# Altium schematic sheet USB U-Turn.SchDoc
size B
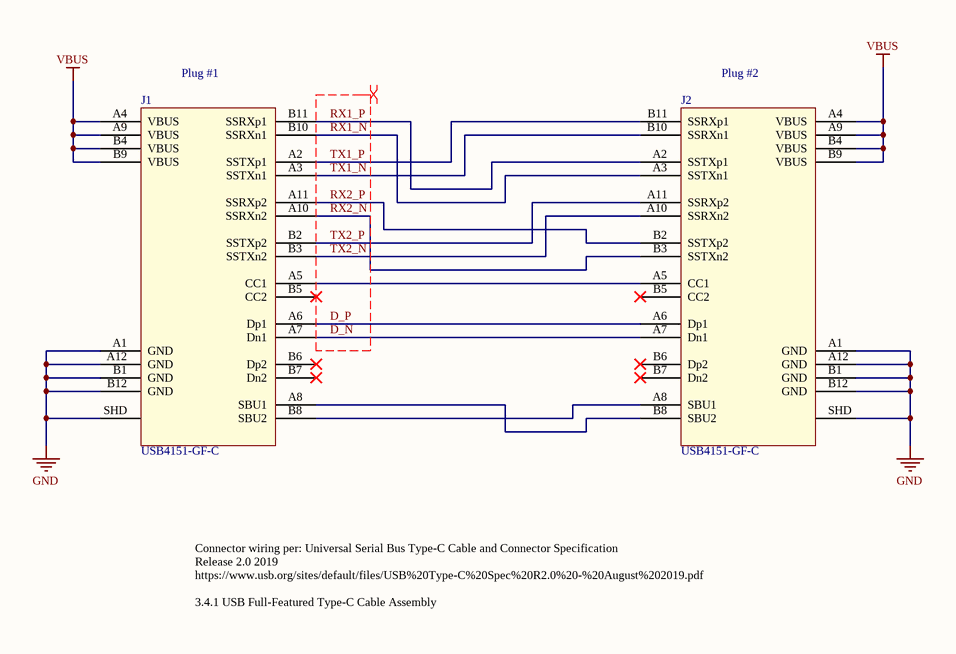
[diagram p0: USB U-Turn.SchDoc]

## Parts
J1  USB4151-GF-C  [USB4151-GF-C]
J2  USB4151-GF-C  [USB4151-GF-C]

## Nets
GND: J1.A1(GND) J1.A12(GND) J1.B1(GND) J1.B12(GND) J1.SHD(B13) J2.A1(GND) J2.A12(GND) J2.B1(GND) J2.B12(GND) J2.SHD(B13)
VBUS: J1.A4(VBUS) J1.A9(VBUS) J1.B4(VBUS) J1.B9(VBUS) J2.A4(VBUS) J2.A9(VBUS) J2.B4(VBUS) J2.B9(VBUS)
D_N: J1.A7(Dn1) J2.A7(Dn1)
D_P: J1.A6(Dp1) J2.A6(Dp1)
RX1_N: J1.B10(SSRXn1) J2.A3(SSTXn1)
RX1_P: J1.B11(SSRXp1) J2.A2(SSTXp1)
RX2_N: J1.A10(SSRXn2) J2.B3(SSTXn2)
RX2_P: J1.A11(SSRXp2) J2.B2(SSTXp2)
TX1_N: J1.A3(SSTXn1) J2.B10(SSRXn1)
TX1_P: J1.A2(SSTXp1) J2.B11(SSRXp1)
TX2_N: J1.B3(SSTXn2) J2.A10(SSRXn2)
TX2_P: J1.B2(SSTXp2) J2.A11(SSRXp2)
NetJ1_A5: J1.A5(CC1) J2.A5(CC1)
NetJ1_A8: J1.A8(SBU1) J2.B8(SBU2)
NetJ1_B8: J1.B8(SBU2) J2.A8(SBU1)

Not connected (* = marked no-connect by the designer): J1 B5(CC2)* B6(Dp2)* B7(Dn2)*; J2 B5(CC2)* B6(Dp2)* B7(Dn2)*

## Layout directives
differential pair; net class USBSS: D_N, D_P, RX1_N, RX1_P, RX2_N, RX2_P, TX1_N, TX1_P, TX2_N, TX2_P

## Notes on the sheet
- (near J1) Plug #1
- (near J2) Plug #2
- Connector wiring per: Universal Serial Bus Type-C Cable and Connector Specification
  Release 2.0 2019
  https://www.usb.org/sites/default/files/USB%20Type-C%20Spec%20R2.0%20-%20August%202019.pdf
  3.4.1 USB Full-Featured Type-C Cable Assembly

## Library data of the parts
J1 J2 = USB4151-GF-C: USB TYPE C, PLUG, SMT , G/F, VER